# Altium schematic sheet Humanoid_Robotic_Hand.SchDoc
size A
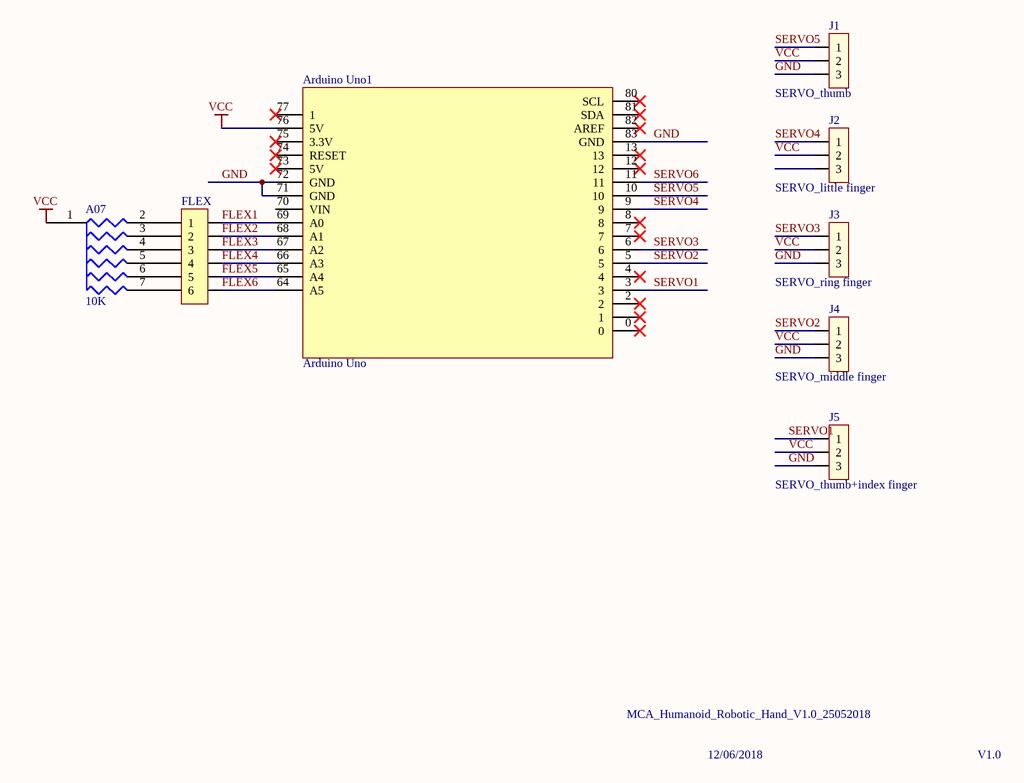
[diagram p0: Humanoid_Robotic_Hand.SchDoc]

## Parts
A07  10K  [RES PACK A07]
Arduino_Uno1  Arduino Uno  [Arduino Uno]
FLEX  (no value)  [JUMPER 6X2]
J1  SERVO_thumb  [JP3]
J2  SERVO_little finger  [JP3]
J3  SERVO_ring finger  [JP3]
J4  SERVO_middle finger  [JP3]
J5  SERVO_thumb+index finger  [JP3]

## Nets
VCC: A07.1 Arduino_Uno1.76(5V) J1.2 J2.2 J3.2 J4.2 J5.2
FLEX1: Arduino_Uno1.69(A0) FLEX.7
FLEX2: Arduino_Uno1.68(A1) FLEX.8
FLEX3: Arduino_Uno1.67(A2) FLEX.9
FLEX4: Arduino_Uno1.66(A3) FLEX.10
FLEX5: Arduino_Uno1.65(A4) FLEX.11
FLEX6: Arduino_Uno1.64(A5) FLEX.12
GND: Arduino_Uno1.71(GND) Arduino_Uno1.72(GND) Arduino_Uno1.83(GND) J1.3 J3.3 J4.3 J5.3
SERVO1: Arduino_Uno1.3 J5.1
SERVO2: Arduino_Uno1.5 J4.1
SERVO3: Arduino_Uno1.6 J3.1
SERVO4: Arduino_Uno1.9 J2.1
SERVO5: Arduino_Uno1.10 J1.1
SERVO6: Arduino_Uno1.11
NetA07_2: A07.2 FLEX.1
NetA07_3: A07.3 FLEX.2
NetA07_4: A07.4 FLEX.3
NetA07_5: A07.5 FLEX.4
NetA07_6: A07.6 FLEX.5
NetA07_7: A07.7 FLEX.6

Not connected (* = marked no-connect by the designer): Arduino_Uno1 0* 1* 2* 4* 7* 8* 12* 13* 70(VIN) 73(5V)* 74(RESET)* 75(3.3V)* 77(1)* 80(SCL)* 81(SDA)* 82(AREF)*; J2 3

## Notes on the sheet
- MCA_Humanoid_Robotic_Hand_V1.0_25052018
- 12/06/2018
- V1.0

## Library data of the parts
A07 = Res Pack A07
FLEX = Jump 6x2_MH: Jump 6x2P 2.54
J1-J5 = JP3: Jumper 3; Value: J3
Arduino_Uno1 = Arduino Uno: LatestRevisionDate: 17-Jul-2002; LatestRevisionNote: Re-released for DXP Platform.; Publisher: Altium Limited